# EAGLE design sot23-6_sot23 (EAGLE 5.11)
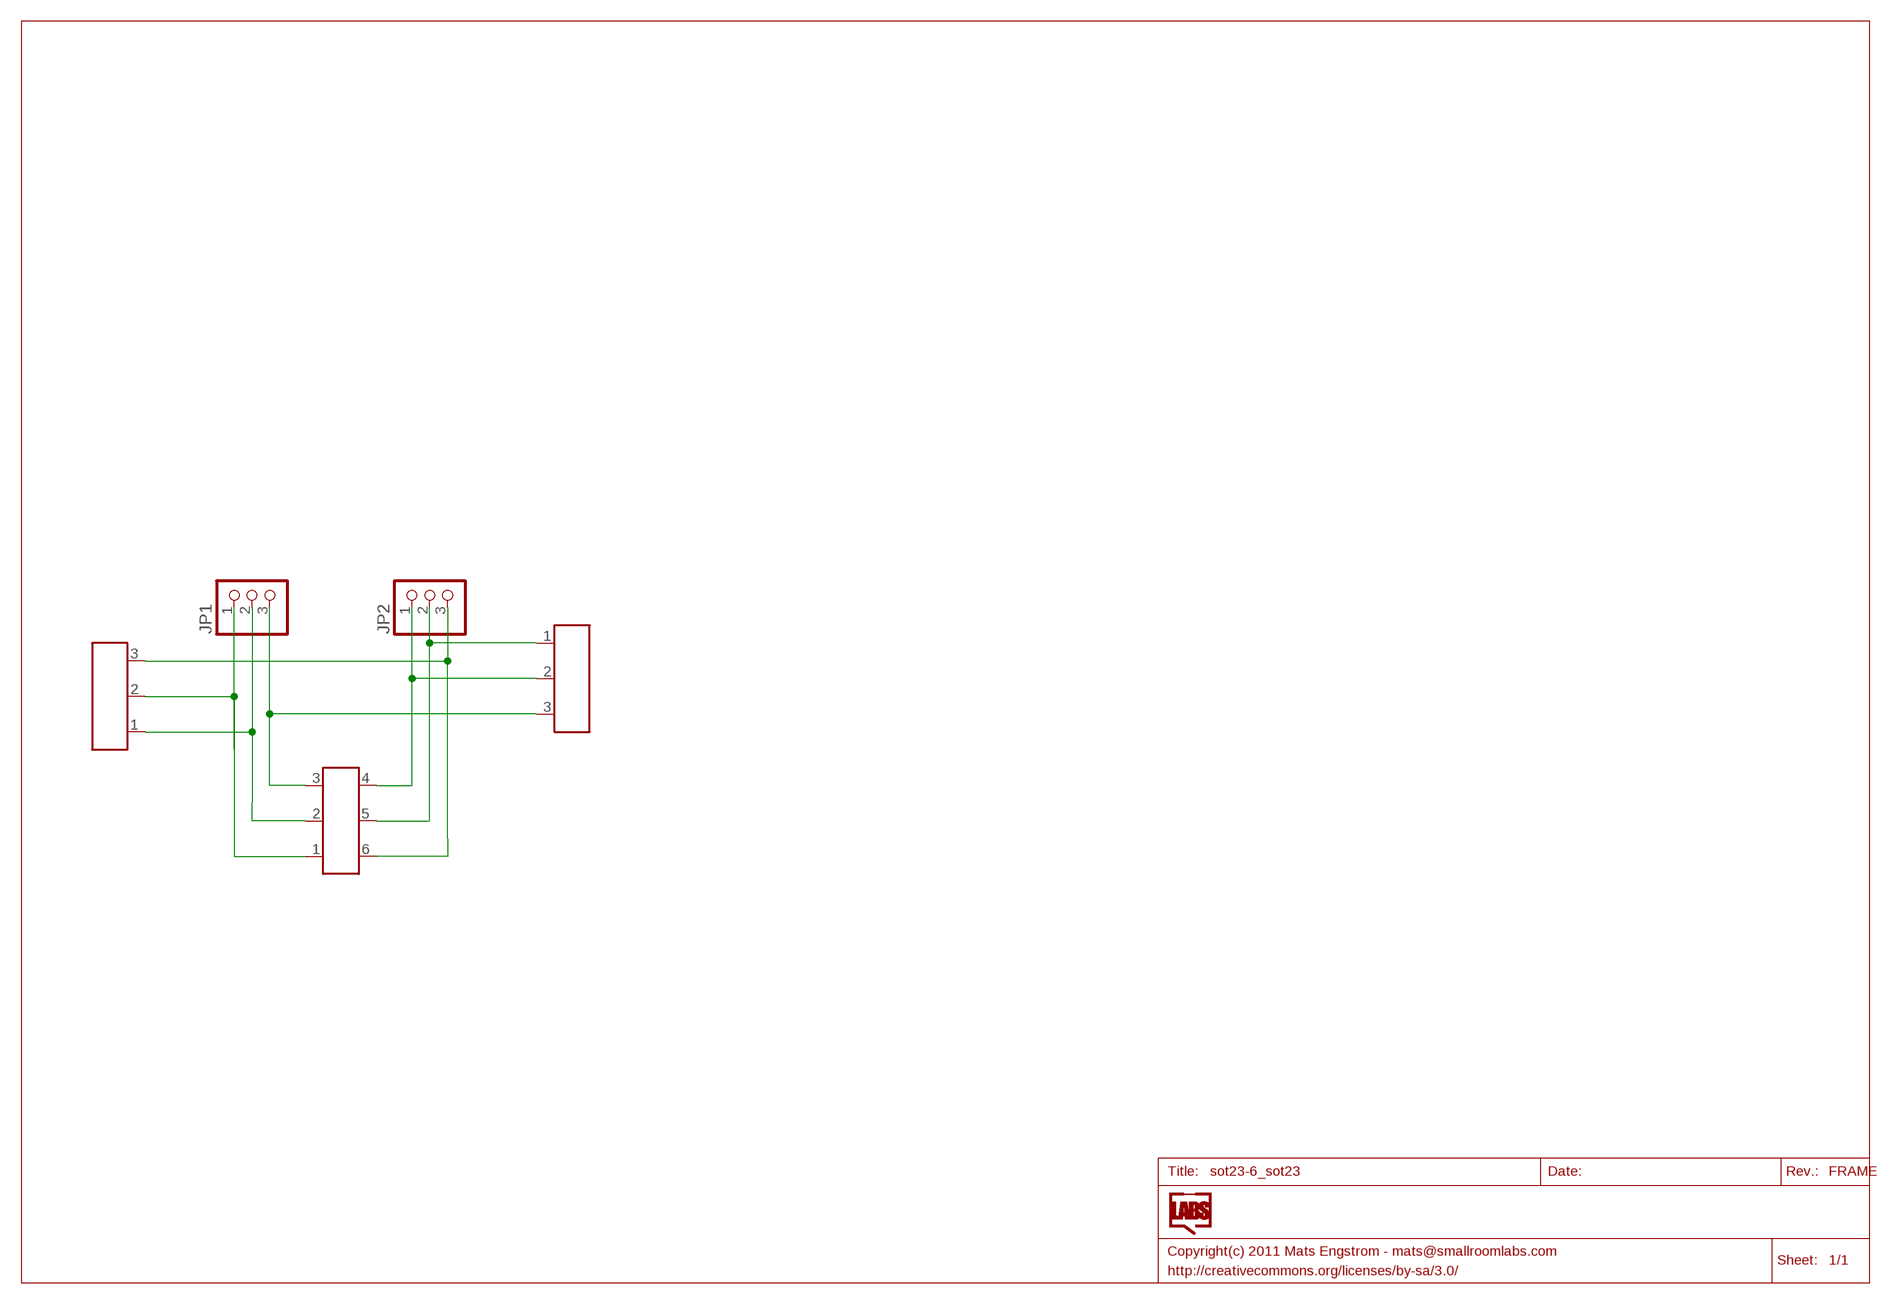
[diagram p0: schematic, sheet 1]

## Parts
IC1  IC6SOT23  [SOT23-6]
IC2  IC3  [SOT23]
IC3  IC3  [SOT23]
JP1  HEADER-1X3ROUND  [1X03_ROUND]
JP2  HEADER-1X3ROUND  [1X03_ROUND]

## Nets
N$1: IC1.1 IC2.2 JP1.1
N$2: IC1.6 IC2.3 JP2.3
N$4: IC1.4 IC3.2 JP2.1
N$5: IC1.5 IC3.1 JP2.2
N$8: IC1.2 IC2.1 JP1.2
N$9: IC1.3 IC3.3 JP1.3

## Library data of the parts
IC1 = SmallRoomLabs:IC6
IC2 IC3 = SmallRoomLabs:IC3
JP1 JP2 = microbuilder:HEADER-1X3: PIN HEADER

## Net classes
0 default: width 0.305 mm, clearance 0.305 mm

## Board
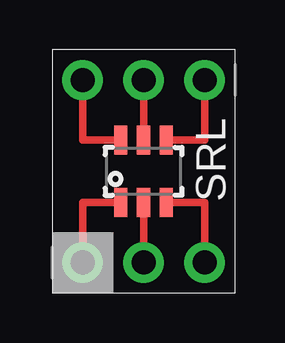
[diagram p1: board, top side]
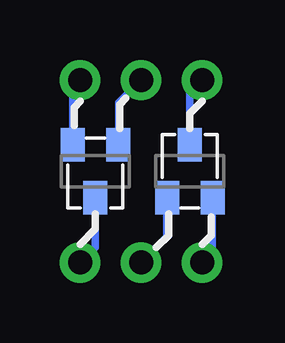
[diagram p2: board, bottom side, seen from below]

No outline drawn. Coordinates in mm, seen from the top.
Copper layers (1*16): Top 0.035mm / dielectric 1.5mm / Bottom 0.035mm
Design rules "default": minimum track width 10mil, minimum drill 24mil, track to track 8mil, track to pad 8mil, pad to pad 8mil, via to via 8mil, smd to smd 8mil, copper to edge 40mil, drill to drill 8mil, minimum pad ring 10mil, minimum via ring 8mil, stop-mask expansion 4mil, vias tented up to drill 0mil, thermal gap 10mil

### Footprints (pad centres in the part's own frame; a part is rotated, then mirrored left to right if it is on the bottom)
SOT23-6 = smd 0.55 x 1.2: 1 0.32,-1.3; 2 1.27,-1.3; 3 2.22,-1.3; 4 2.22,1.3; 5 1.27,1.3; 6 0.32,1.3
SOT23 = smd 1 x 1.4: 1 -0.95,-1.1; 2 0.95,-1.1; 3 0,1.1
1X03_ROUND = drill 1 pad 1.676 round: 1 -2.54,0; 2 0,0; 3 2.54,0

### Placement (x,y rotation side)
IC1  2.54,5.08 0 top
IC2  1.78,5.08 0 bottom
IC3  5.71,5.08 180 bottom
JP1  3.81,1.27 0 top
JP2  3.81,8.89 180 top

### Tracks (layer width: path | path; a pad name or v marks a point on that pad's centre or on a via)
N$1
  Top 0.305: JP1.1 1.27,3.78 1.45,3.79 2.85,3.79 IC1.1
  Bottom 0.305: JP1.1 0.84,1.7 0.84,3.96 IC2.2
N$2
  Top 0.305: IC1.6 2.85,6.38 1.45,6.38 1.27,6.38 1.27,6.53 JP2.3
  Bottom 0.305: JP2.3 1.78,8.38 1.78,6.2 IC2.3
N$4
  Top 0.305: JP2.1 6.35,6.38 6.17,6.38 4.78,6.38 IC1.4
  Bottom 0.305: JP2.1 6.66,8.59 6.66,6.2 IC3.2
N$5
  Top 0.305: JP2.2 3.81,6.4 IC1.5
  Bottom 0.305: JP2.2 4.75,7.95 4.75,6.2 IC3.1
N$8
  Top 0.305: JP1.2 3.81,3.76 IC1.2
  Bottom 0.305: JP1.2 2.74,2.34 2.74,3.96 IC2.1
N$9
  Top 0.305: JP1.3 6.35,3.78 6.17,3.79 4.78,3.79 IC1.3
  Bottom 0.305: JP1.3 5.71,1.91 5.71,3.96 IC3.3

### Text on the board
tPlace: SRL